# EAGLE schematic ventillattor schem (EAGLE 9.6.0)
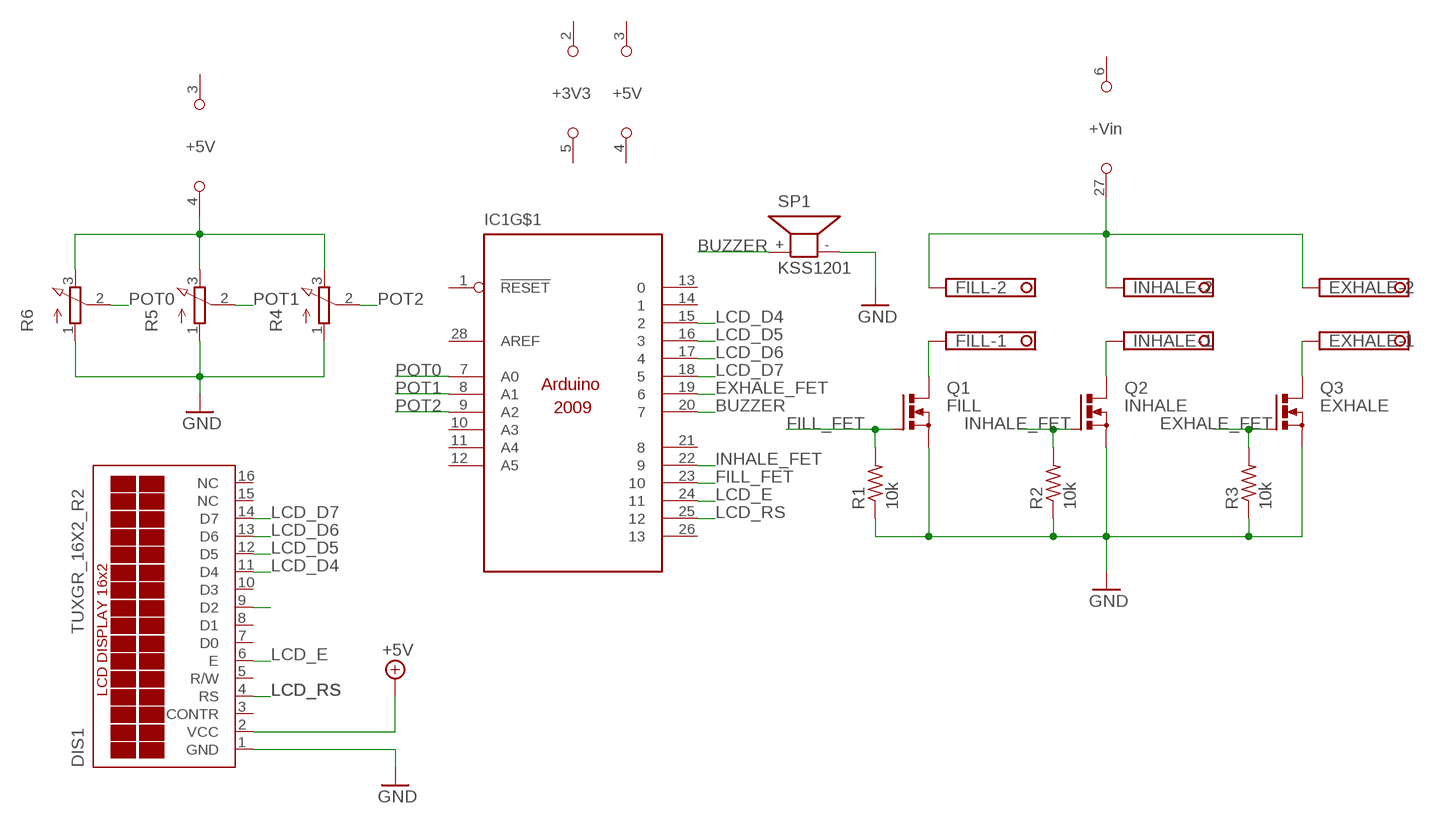
[diagram p0: schematic, sheet 1]

## Parts
DIS1  TUXGR_16X2_R2  [TUXGR_16X2_R2]
EXHALE  TERMINAL-BLOCK-3.5MM-2-PIN-LONG-PAD  [TERMINAL-BLOCK-2-PIN-3.5MM-LONG-PAD]
FILL  TERMINAL-BLOCK-3.5MM-2-PIN-LONG-PAD  [TERMINAL-BLOCK-2-PIN-3.5MM-LONG-PAD]
IC1  ARDUINO2009_20  [ARDUINO2009]
IC2  ARDUINO2009_20  [ARDUINO2009]
INHALE  TERMINAL-BLOCK-3.5MM-2-PIN-LONG-PAD  [TERMINAL-BLOCK-2-PIN-3.5MM-LONG-PAD]
Q1  FILL  PMOSFET_NTO220BV  [TO220BV]
Q2  INHALE  PMOSFET_NTO220BV  [TO220BV]
Q3  EXHALE  PMOSFET_NTO220BV  [TO220BV]
R1  10k  R-US_0204/7  [0204/7]
R2  10k  R-US_0204/7  [0204/7]
R3  10k  R-US_0204/7  [0204/7]
R4  3RP/1610N  [3RP/1610N]
R5  3RP/1610N  [3RP/1610N]
R6  3RP/1610N  [3RP/1610N]
SP1  KSS1201  [KSS1201]

## Nets
+5V: DIS1.2(VCC)
BUZZER: IC1.20 SP1.+
EXHALE_FET: IC1.19 Q3.G R3.2
FILL_FET: IC1.23 Q1.G R1.2
GND: DIS1.1(GND) Q1.S Q2.S Q3.S R1.1 R2.1 R3.1 R4.1(A) R5.1(A) R6.1(A) SP1.-
INHALE_FET: IC1.22 Q2.G R2.2
LCD_D2: DIS1.9(D2)
LCD_D4: DIS1.11(D4) IC1.15
LCD_D5: DIS1.12(D5) IC1.16
LCD_D6: DIS1.13(D6) IC1.17
LCD_D7: DIS1.14(D7) IC1.18
LCD_E: DIS1.6(E) IC1.24
LCD_RS: DIS1.4(RS) IC1.25
N$2: IC2.4(GND) R4.3(E) R5.3(E) R6.3(E)
N$4: FILL.1 Q1.D
N$5: INHALE.1 Q2.D
N$6: EXHALE.1 Q3.D
N$7: EXHALE.2 FILL.2 IC1.27(GND) INHALE.2
POT0: IC1.7(A0) R6.2(S)
POT1: IC1.8(A1) R5.2(S)
POT2: IC1.9(A2) R4.2(S)
Unconnected: DIS1.3(CONTR) DIS1.5(R/W) DIS1.7(D0) DIS1.8(D1) DIS1.10(D3) DIS1.15(NC) DIS1.16(NC) IC1.1(!RESET) IC1.10(A3) IC1.11(A4) IC1.12(A5) IC1.13 IC1.14 IC1.21 IC1.26 IC1.28(AREF) IC2.1(!RESET) IC2.7(A0) IC2.8(A1) IC2.9(A2) IC2.10(A3) IC2.11(A4) IC2.12(A5) IC2.13 IC2.14 IC2.15 IC2.16 IC2.17 IC2.18 IC2.19 IC2.20 IC2.21 IC2.22 IC2.23 IC2.24 IC2.25 IC2.26 IC2.28(AREF)

## Power pins joined to a net without a drawn wire
+3V3: IC1.2(+3V3) IC2.2(+3V3)
+5V: IC1.3(+5V) IC2.3(+5V)
+VIN: IC1.6(+VIN) IC2.6(+VIN)
GND: IC1.4(GND) IC1.5(GND) IC2.5(GND) IC2.27(GND)

## Library data of the parts
DIS1 = display-lcd:TUXGR_16X2_R2: Tuxgraphics LCD display 16x2 characters reflective, without background light Source: tuxgr_12x2_r2.pdf; OC_FARNELL: unknown; OC_NEWARK: unknown
EXHALE FILL INHALE = Rembrandt Electronics - Terminal Block 3-5mm v1-0:TERMINAL-BLOCK-3.5MM-2-PIN: Terminal Block 3.5mm Pitch: 3,5 mm Number of pins: 2 Created by Rembrandt Electronics www.rembrandtelectronics.com
IC1 IC2 = arduino:ARDUINO2009_2: The Arduino Duemilanove ("2009") is a microcontroller board based on the ATmega168 or ATmega328. - 14 digital input/output pins (of which 6 can be used as PWM outputs) - 6 analog inputs, a 16 MHz crystal oscillator - USB connection - power jack - ISP header - reset button It contains everything needed to support the microcontroller; simply connect it to a computer with a USB cable or power it with a AC-to-DC adapter or battery to get started http://arduino.cc/en/Main/ArduinoBoardDuemilanove
Q1-Q3 = transistor-power:PMOSFET_N: Power MOSFET N-Channel
R1-R3 = rcl:R-US_: RESISTOR, American symbol; SPICEPREFIX: R
R4-R6 = P160KNPD:3RP/1610N: 16mm Potentiometer one level Source: http://www.alphapotentiometers.net/html/16mm_pot_2.html
SP1 = buzzer:KSS1201: SPEAKER Source: Schukat; OC_FARNELL: unknown; OC_NEWARK: unknown